# EAGLE design solenoidDriver (EAGLE 8.7.0)
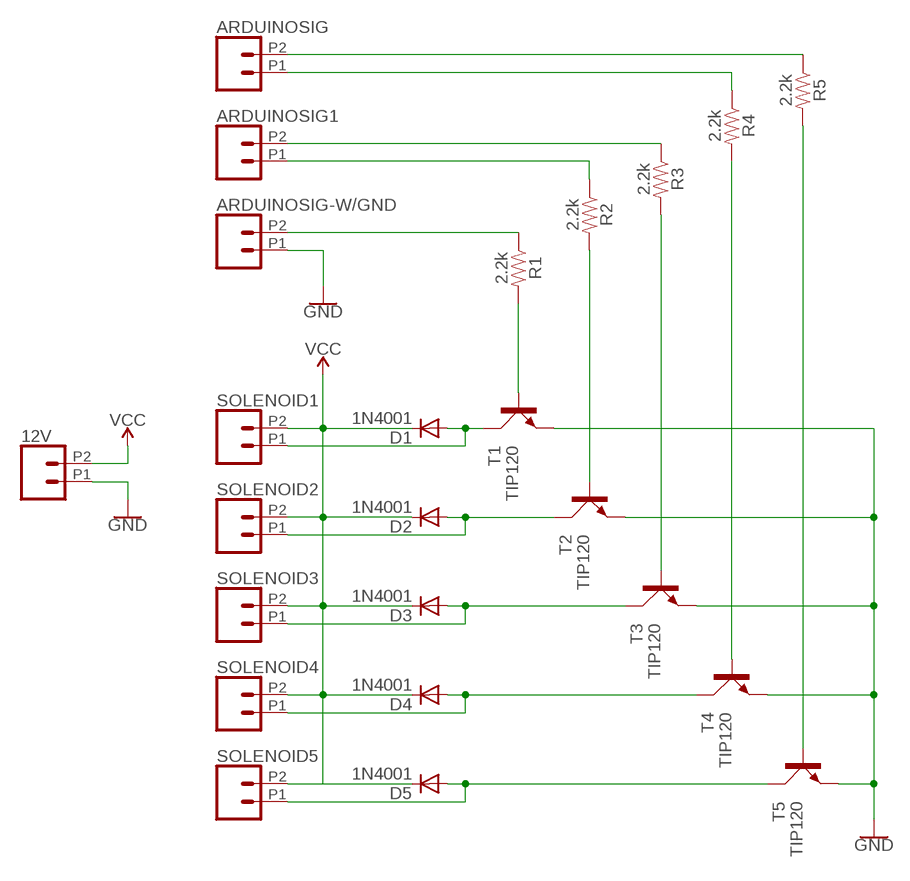
[diagram p0: schematic, sheet 1]

## Parts
12V  CONN_022.54MM_SCREWTERM  [1X02_2.54_SCREWTERM]
ARDUINOSIG  CONN_022.54MM_SCREWTERM  [1X02_2.54_SCREWTERM]
ARDUINOSIG1  CONN_022.54MM_SCREWTERM  [1X02_2.54_SCREWTERM]
ARDUINOSIG-W/GND  CONN_022.54MM_SCREWTERM  [1X02_2.54_SCREWTERM]
D1  1N4001  1N4004  [DO41-10]
D2  1N4001  1N4004  [DO41-10]
D3  1N4001  1N4004  [DO41-10]
D4  1N4001  1N4004  [DO41-10]
D5  1N4001  1N4004  [DO41-10]
R1  2.2k  10KOHM-HORIZ_KIT-1/4W-1%  [AXIAL-0.3-KIT]
R2  2.2k  10KOHM-HORIZ_KIT-1/4W-1%  [AXIAL-0.3-KIT]
R3  2.2k  10KOHM-HORIZ_KIT-1/4W-1%  [AXIAL-0.3-KIT]
R4  2.2k  10KOHM-HORIZ_KIT-1/4W-1%  [AXIAL-0.3-KIT]
R5  2.2k  10KOHM-HORIZ_KIT-1/4W-1%  [AXIAL-0.3-KIT]
SOLENOID1  CONN_022.54MM_SCREWTERM  [1X02_2.54_SCREWTERM]
SOLENOID2  CONN_022.54MM_SCREWTERM  [1X02_2.54_SCREWTERM]
SOLENOID3  CONN_022.54MM_SCREWTERM  [1X02_2.54_SCREWTERM]
SOLENOID4  CONN_022.54MM_SCREWTERM  [1X02_2.54_SCREWTERM]
SOLENOID5  CONN_022.54MM_SCREWTERM  [1X02_2.54_SCREWTERM]
T1  TIP120  TIP120-NOHOLE  [TO220AH-NOHOLE]
T2  TIP120  TIP120-NOHOLE  [TO220AH-NOHOLE]
T3  TIP120  TIP120-NOHOLE  [TO220AH-NOHOLE]
T4  TIP120  TIP120-NOHOLE  [TO220AH-NOHOLE]
T5  TIP120  TIP120-NOHOLE  [TO220AH-NOHOLE]

## Nets
GND: 12V.P1 ARDUINOSIG-W/GND.P1 T1.E T2.E T3.E T4.E T5.E
N$2: R1.P$2 T1.B
N$4: ARDUINOSIG-W/GND.P2 R1.P$1
N$6: ARDUINOSIG.P2 R5.P$1
N$7: R5.P$2 T5.B
N$10: ARDUINOSIG.P1 R4.P$1
N$11: R4.P$2 T4.B
N$12: ARDUINOSIG1.P2 R3.P$1
N$13: R3.P$2 T3.B
N$14: ARDUINOSIG1.P1 R2.P$1
N$15: R2.P$2 T2.B
N$18: D2.A SOLENOID2.P1 T2.C
N$19: D1.A SOLENOID1.P1 T1.C
N$20: D4.A SOLENOID4.P1 T4.C
N$21: D3.A SOLENOID3.P1 T3.C
N$22: D5.A SOLENOID5.P1 T5.C
VCC: 12V.P2 D1.C D2.C D3.C D4.C D5.C SOLENOID1.P2 SOLENOID2.P2 SOLENOID3.P2 SOLENOID4.P2 SOLENOID5.P2

## Library data of the parts
12V ARDUINOSIG ARDUINOSIG1 ARDUINOSIG-W/GND SOLENOID1-SOLENOID5 = SparkFun-Connectors:CONN_02: Multi connection point. Often used as Generic Header-pin footprint for 0.1 inch spaced/style header connections On any of the 0.1 inch spaced packages, you can populate with these: Break Away Headers - Straight <https://www.sparkfun.com/products/116> (PRT-00116) Break Away Male Headers - Right Angle <https://www.sparkfun.com/products/553> (PRT-00553) Female Headers <https://www.sparkfun.com/products/115> (PRT-00115) Break Away Headers - Machine Pin <https://www.sparkfun.com/products/117> (PRT-00117) Break Away Female Headers - Swiss Machine Pin <https://www.sparkfun.com/products/743> (PRT-00743) For SCREWTERMINALS and SPRING TERMINALS visit here: Screw Terimnals on SparkFun.com <https://www.sparkfun.com/search/results?term=Screw+Terminals> (5mm/3.5mm/2.54mm spacing) This device is also useful as a general connection point to wire up your design to another part of your project. Our various solder wires solder well into these plated through hole pads. Hook-Up Wire - Assortment (Stranded, 22 AWG) <https://www.sparkfun.com/products/11375> (PRT-11375) Hook-Up Wire - Assortment (Solid Core, 22 AWG) <https://www.sparkfun.com/products/11367> (PRT-11367) View the entire wire category on our website here <https://www.sparkfun.com/categories/141> Special notes: Molex polarized connector foot print use with: PRT-08233 with associated crimp pins and housings. 2.54_SCREWTERM for use with PRT-10571. 3.5mm Screw Terminal footprints for PRT-08084 5mm Screw Terminal footprints for use with PRT-08432
D1-D5 = adafruit:1N4004: DIODE General purpose 1N400x type rectifier (With bigger pads) http://www.ladyada.net/library/pcb/eaglelibrary.html
R1-R5 = SparkFun-Resistors:10KOHM: 10kΩ resistor A resistor is a passive two-terminal electrical component that implements electrical resistance as a circuit element. Resistors act to reduce current flow, and, at the same time, act to lower voltage levels within circuits. - Wikipedia; PROD_ID: RES-12183; VALUE: 10k
T1-T5 = transistor-power:TIP120-NOHOLE

## Board
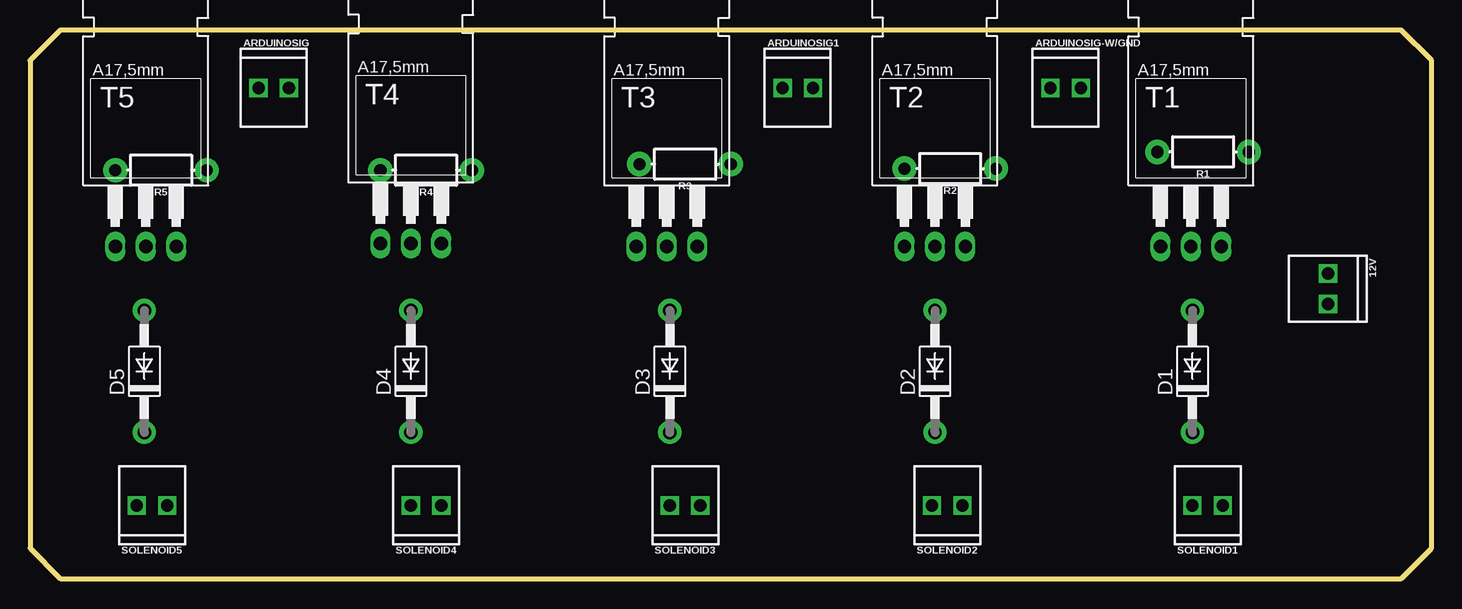
[diagram p1: board, top side]
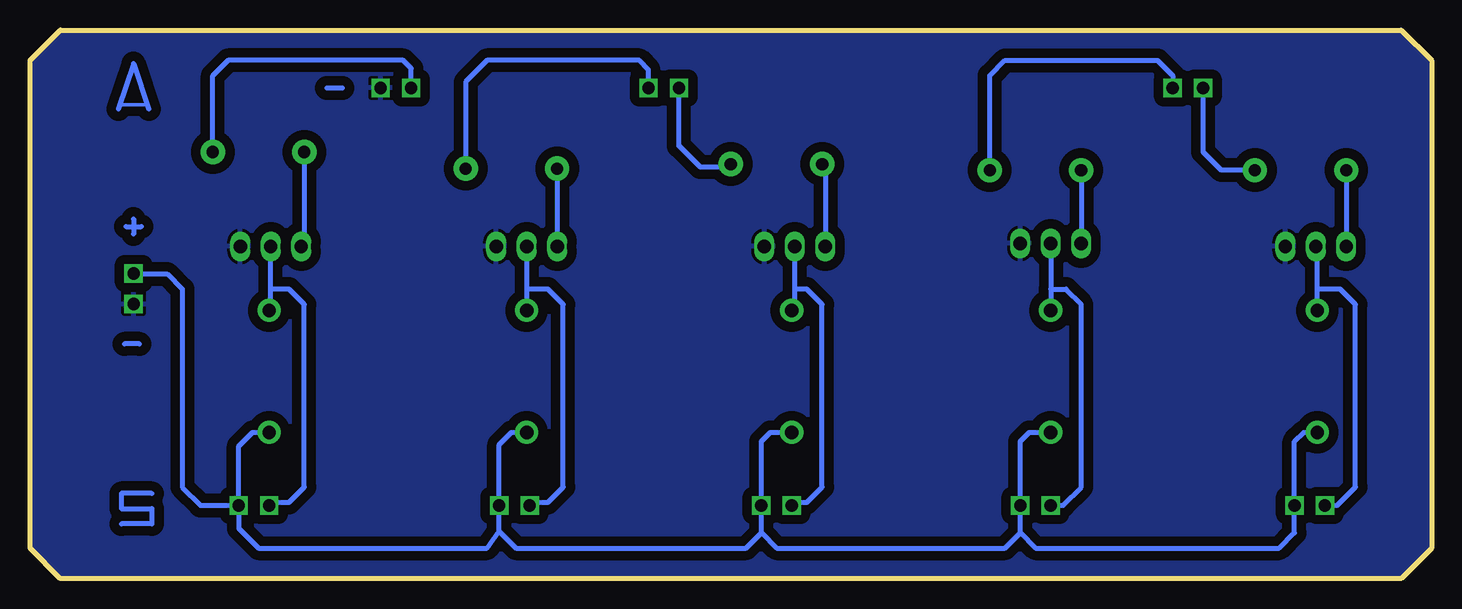
[diagram p2: board, bottom side, seen from below]

Size 116.84 x 45.72 mm. Coordinates in mm from the lower left corner, seen from the top.
Outline: 0,43.18 0,2.54 2.54,0 114.3,0 116.84,2.54 116.84,43.18 114.3,45.72 2.54,45.72 0,43.18
Copper layers (1*16): Top 0.035mm / dielectric 1.5mm / Bottom 0.035mm
Design rules "OthermillDRC_1_32_v2": minimum track width 8mil, minimum drill 0.8mm, track to track 0.794003125mm, track to pad 0.794003125mm, pad to pad 0.794003125mm, via to via 0.794003125mm, smd to smd 0mil, copper to edge 0mil, drill to drill 1mil, minimum pad ring 10mil, minimum via ring 10mil, stop-mask expansion 1mil, vias tented up to drill 30mil, thermal gap 10mil

### Footprints (pad centres in the part's own frame; a part is rotated, then mirrored left to right if it is on the bottom)
1X02_2.54_SCREWTERM = drill 1.016 square: P1 2.54,0; P2 0,0
DO41-10 = drill 1.118 pad 1.93: A 5.08,0; C -5.08,0
AXIAL-0.3-KIT = drill 1.016 pad 2.032: P$1 -3.81,0; P$2 3.81,0
TO220AH-NOHOLE = drill 1.118 long: B -3.81,-11.43; C -1.27,-11.43; E 1.27,-11.43

### Placement (x,y rotation side)
12V  108.2,25.43 270 top
ARDUINOSIG  19.05,40.89 0 top
ARDUINOSIG1  62.74,40.89 0 top
ARDUINOSIG-W/GND  85.06,40.89 0 top
D1  96.9,17.27 90 top
D2  75.44,17.27 90 top
D3  53.34,17.27 90 top
D4  31.75,17.27 90 top
D5  9.53,17.27 90 top
R1  97.79,35.56 180 top
R2  76.71,34.16 180 top
R3  54.61,34.54 180 top
R4  33.02,34.04 180 top
R5  10.92,34.04 180 top
SOLENOID1  99.44,6.1 180 top
SOLENOID2  77.72,6.1 180 top
SOLENOID3  55.88,6.1 180 top
SOLENOID4  34.29,6.1 180 top
SOLENOID5  11.43,6.1 180 top
T1  98.04,39.12 0 top
T2  76.71,39.12 0 top
T3  54.36,39.12 0 top
T4  33.02,39.37 0 top
T5  10.92,39.12 0 top

### Tracks (layer width: path | path; a pad name or v marks a point on that pad's centre or on a via)
GND
  pour Bottom: 114.3,45.72 2.54,45.72 0,43.18 0,2.54 2.54,0 114.3,0 116.84,2.54 116.84,43.18
N$1
  Bottom 0.406: 92.08,40.89 90.81,40.89
N$2
  Bottom 0.406: R1.P$2 93.98,27.94 T1.B
N$3
  Bottom 0.406: 106.93,39.12 108.2,42.93 109.47,39.12
N$4
  Bottom 0.406: R1.P$1 101.6,41.91 100.33,43.18 85.73,43.18 85.06,42.52 ARDUINOSIG-W/GND.P2
N$5
  Bottom 0.406: 107.7,19.56 108.97,19.56
N$6
  Bottom 0.406: R5.P$1 17.53,34.04 19.05,35.56 ARDUINOSIG.P2
N$7
  Bottom 0.406: R5.P$2 T5.B
N$8
  Bottom 0.406: 108.84,29.34 107.57,29.34
N$9
  Bottom 0.406: 108.2,29.97 108.2,28.7
N$10
  Bottom 0.406: R4.P$1 36.83,41.91 35.56,43.18 22.86,43.18 21.59,41.91 ARDUINOSIG.P1
N$11
  Bottom 0.406: R4.P$2 T4.B
N$12
  Bottom 0.406: R3.P$1 58.67,34.29 60.96,34.29 62.74,36.07 ARDUINOSIG1.P2
N$13
  Bottom 0.406: R3.P$2 50.55,34.29 T3.B
N$14
  Bottom 0.406: ARDUINOSIG1.P1 65.28,42.42 66.04,43.18 78.74,43.18 80.52,41.4 R2.P$1
N$15
  Bottom 0.406: R2.P$2 T2.B
N$18
  Bottom 0.406: T2.C 75.44,24.13 | 75.44,24.13 D2.A | SOLENOID2.P1 74.93,6.35 73.66,6.35 72.39,7.62 72.39,22.86 73.66,24.13 75.44,24.13
N$19
  Bottom 0.406: D1.A 96.77,22.48 96.77,24.13 | 96.77,24.13 T1.C | SOLENOID1.P1 96.65,6.35 95.25,6.35 93.98,7.62 93.98,22.86 95.25,24.13 96.77,24.13
N$20
  Bottom 0.406: 31.5,27.69 T4.C 31.75,24.13 | SOLENOID4.P1 30.73,6.1 29.21,7.62 29.21,22.86 30.48,24.13 31.75,24.13 | 31.75,24.13 D4.A
N$21
  Bottom 0.406: D3.A 53.09,22.61 53.09,24.13 | 53.09,24.13 T3.C | SOLENOID3.P1 53.09,6.35 52.07,6.35 50.8,7.62 50.8,22.86 52.07,24.13 53.09,24.13
N$22
  Bottom 0.406: D5.A 9.53,24.13 | 9.53,24.13 9.53,27.56 T5.C | 9.53,24.13 7.62,24.13 6.35,22.86 6.35,7.62 7.87,6.1 SOLENOID5.P1
N$23
  Bottom 0.305: 109.22,39.5 107.06,39.5
N$26
  Bottom 0.406: 106.68,7.11 109.22,7.11 109.22,5.84 106.68,5.84 106.68,4.57 109.22,4.57
VCC
  Bottom 0.406: D5.C 10.67,12.19 11.43,11.43 11.43,6.35 SOLENOID5.P2 11.43,3.81 12.7,2.54 33.02,2.54 34.29,3.81 | D4.C 33.53,12.19 34.29,11.43 SOLENOID4.P2 34.29,3.81 | D2.C 76.71,12.19 77.72,11.18 SOLENOID2.P2 77.72,3.94 | 97.28,12.19 D1.C 98.3,12.19 99.44,11.05 SOLENOID1.P2 | D3.C 55.12,12.19 55.88,11.43 SOLENOID3.P2 55.88,3.81 | 12V.P2 108.18,25.4 105.41,25.4 104.14,24.13 104.14,7.62 102.62,6.1 SOLENOID1.P2 | SOLENOID1.P2 99.44,4.19 97.79,2.54 78.74,2.54 77.72,3.94 | 77.72,3.94 76.33,2.54 57.15,2.54 55.88,3.81 | 55.88,3.81 54.61,2.54 35.56,2.54 34.29,3.81